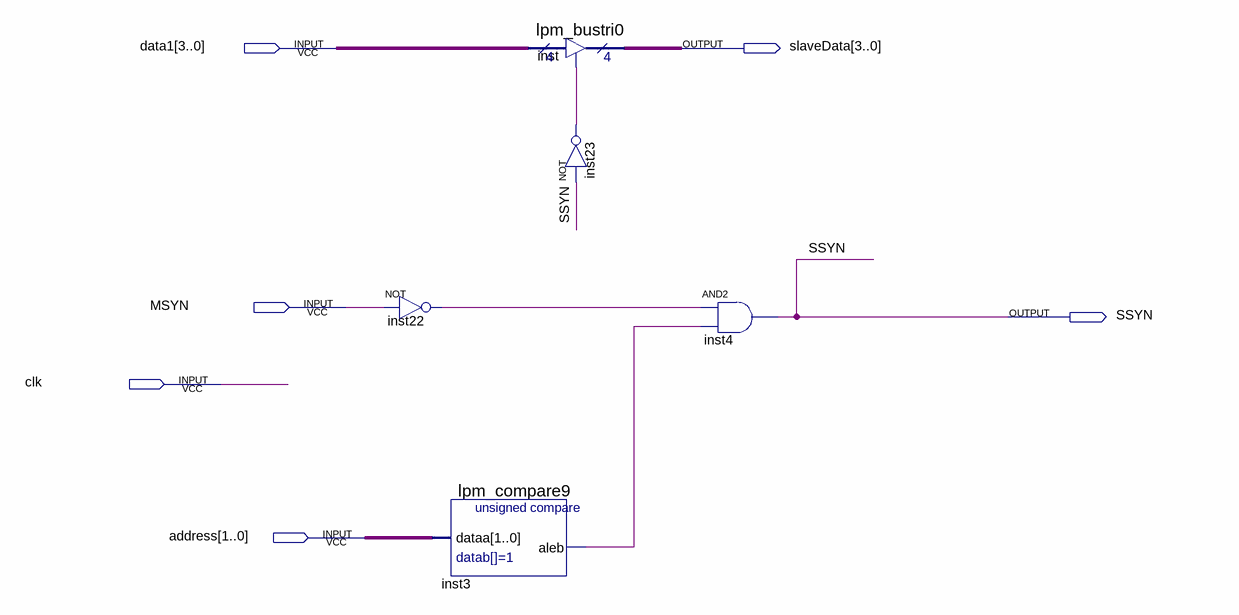
[diagram p0: schematic sheet]
// Quartus schematic slave2.bdf as structural Verilog: 5 symbols, 6 pins
module slave2 (
  input  [3:0] data1,
  input  MSYN,
  input  clk,
  input  [1:0] address,
  output [3:0] slaveData,
  output SSYN
);

  wire inst3_aleb, inst22_out, inst23_out;

  not inst22 (inst22_out, MSYN);
  lpm_compare9 inst3 (.dataa(address), .aleb(inst3_aleb));
  lpm_bustri0 inst (.enabledt(inst23_out), .data(data1), .tridata(slaveData));
  not inst23 (inst23_out, SSYN);
  and inst4 (SSYN, inst22_out, inst3_aleb);
endmodule
